# EAGLE design as5147_breakout (EAGLE 6.5.0)
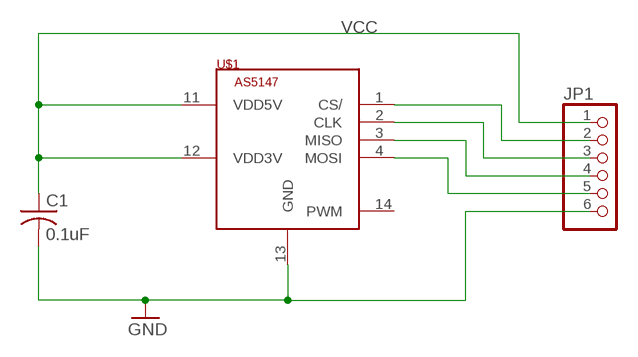
[diagram p0: schematic, sheet 1]

## Parts
C1  0.1uF  C-USC0603  [C0603]
JP1  PINHD-1X6  [1X06]
U$1  AS5147  [TSSOP14]

## Nets
GND: C1.2 JP1.6 U$1.13(GND)
N$3: JP1.5 U$1.4(MOSI)
N$4: JP1.4 U$1.3(MISO)
N$5: JP1.3 U$1.2(CLK)
N$6: JP1.2 U$1.1(CS/)
VCC: C1.1 JP1.1 U$1.11(VDD5V) U$1.12(VDD3V)
Unconnected: U$1.14(PWM)

## Library data of the parts
C1 = rcl:C-US: CAPACITOR, American symbol
JP1 = pinhead:PINHD-1X6: PIN HEADER
U$1 = as5147_breakout:AS5147

## Net classes
0 default: width 0.254 mm

## Board
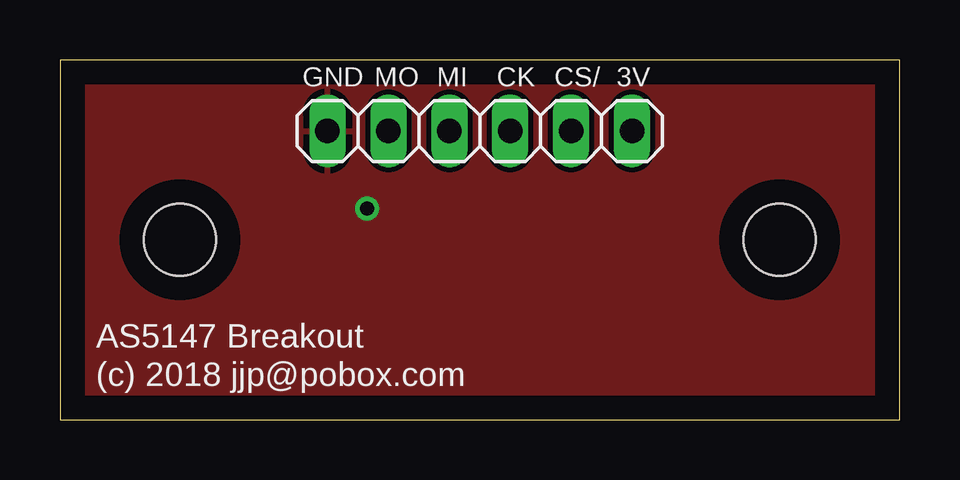
[diagram p1: board, top side]
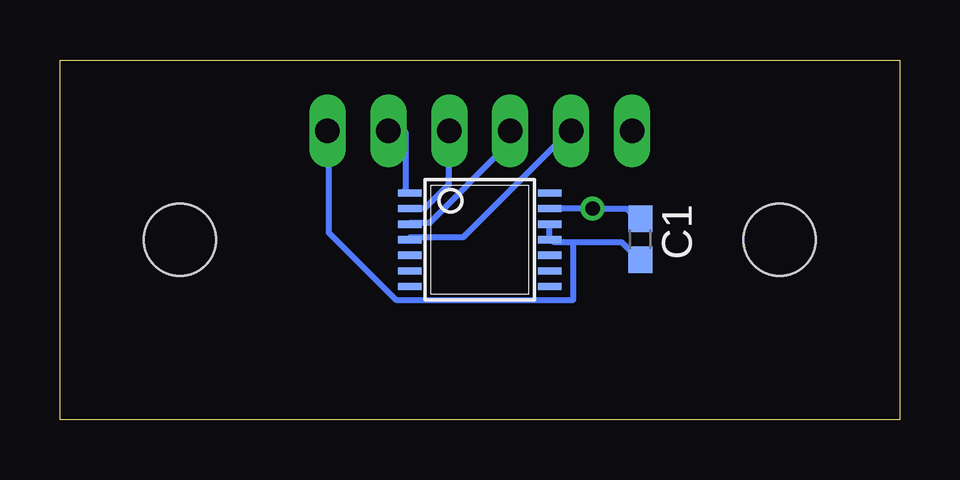
[diagram p2: board, bottom side, seen from below]

Size 35 x 15 mm. Coordinates in mm from the lower left corner, seen from the top.
Outline: 0,0 35,0 35,15 0,15 0,0
Copper layers (1*16): Top 0.035mm / dielectric 1.5mm / Bottom 0.035mm
Design rules "default": minimum track width 10mil, minimum drill 24mil, track to track 8mil, track to pad 8mil, pad to pad 8mil, via to via 8mil, smd to smd 8mil, copper to edge 40mil, drill to drill 8mil, minimum pad ring 10mil, minimum via ring 8mil, stop-mask expansion 4mil, vias tented up to drill 0mil, thermal gap 10mil
Holes 3 mm at 5,7.5 30,7.5

### Footprints (pad centres in the part's own frame; a part is rotated, then mirrored left to right if it is on the bottom)
C0603 = smd 1.1 x 1: 1 -0.85,0; 2 0.85,0
1X06 = drill 1.016 long: 1 -6.35,0; 2 -3.81,0; 3 -1.27,0; 4 1.27,0; 5 3.81,0; 6 6.35,0
TSSOP14 = smd 0.305 x 0.991: 1 -1.95,-2.918; 2 -1.3,-2.918; 3 -0.65,-2.918; 4 0,-2.918; 5 0.65,-2.918; 6 1.3,-2.918; 7 1.95,-2.918; 8 1.95,2.918; 9 1.3,2.918; 10 0.65,2.918; 11 0,2.918; 12 -0.65,2.918; 13 -1.3,2.918; 14 -1.95,2.918

### Placement (x,y rotation side)
C1  10.81,7.52 90 bottom
JP1  17.5,12.04 180 top
U$1  17.5,7.5 270 bottom

### Tracks (layer width: path | path; a pad name or v marks a point on that pad's centre or on a via)
GND  (via drill 0.6)
  Bottom 0.254: U$1.13 v12.8,8.8 11.4,8.8 11,8.4 C1.2
  pour Top: 0.3,0.3 34.7,0.3 34.7,14.7 0.3,14.7
N$3
  Bottom 0.254: U$1.4 20.4,7.6 18.2,7.6 13.8,12 JP1.5
N$4
  Bottom 0.254: U$1.3 20.4,8.2 19.6,8.2 16.4,11.4 16.4,12 JP1.4
N$5
  Bottom 0.254: U$1.2 19.8,8.8 18.8,9.8 18.8,12 JP1.3
N$6
  Bottom 0.254: U$1.1 20.6,9.6 20.6,12 21.2,12 JP1.2
VCC
  Bottom 0.254: U$1.12 14.6,8 14.6,7.6 U$1.11 14.4,7.4 13.6,7.4 | 13.6,7.4 11.6,7.4 11,6.8 C1.1 | 13.6,7.4 13.6,5 21,5 23.8,7.8 23.8,12 JP1.1

### Text on the board
tNames: GND | MO | MI | CK | CS/ | 3V | AS5147 Breakout | (c) 2018 jjp@pobox.com